# EAGLE design Spectrometer_v1.0 (EAGLE 9.3.0)
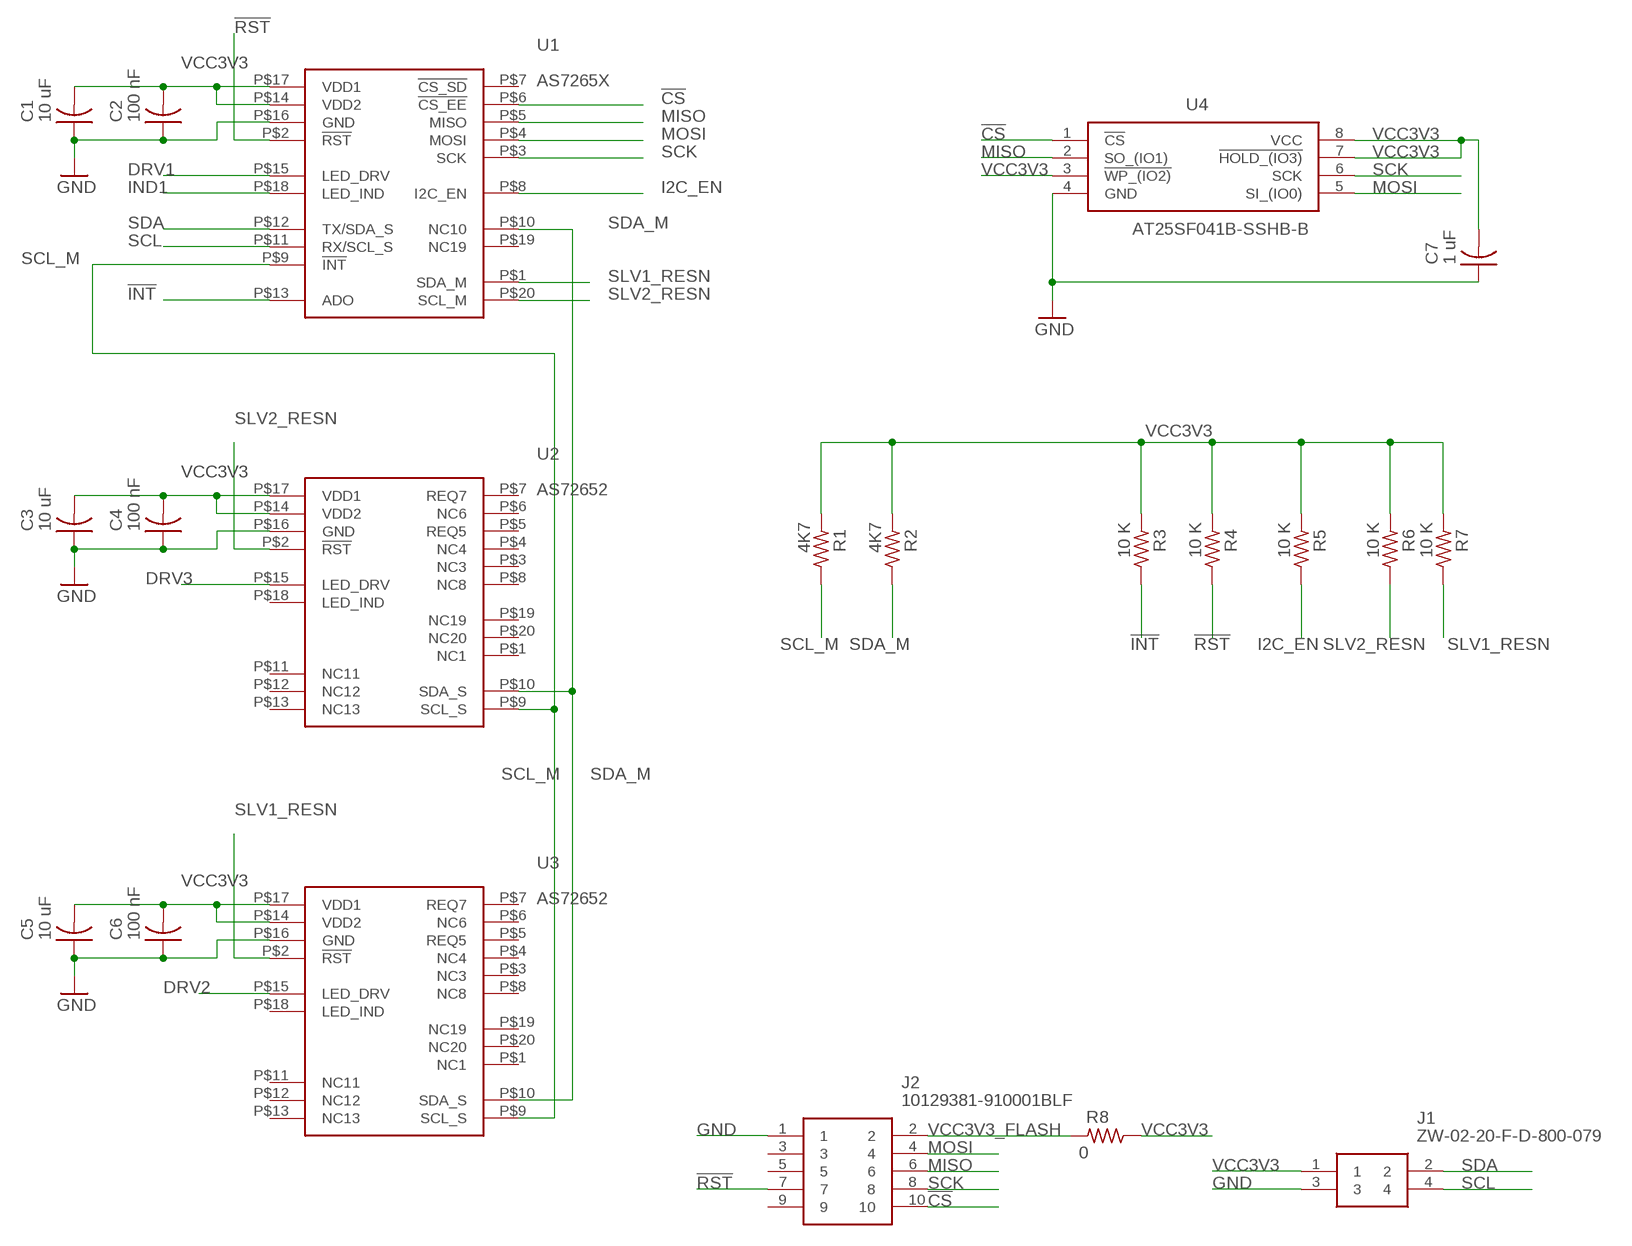
[diagram p0: schematic, sheet 1]

## Parts
C1  10 uF  CAPACITOR-SMD-0805  [SMD-0805]
C2  100 nF  CAPACITOR-SMD-0805  [SMD-0805]
C3  10 uF  CAPACITOR-SMD-0805  [SMD-0805]
C4  100 nF  CAPACITOR-SMD-0805  [SMD-0805]
C5  10 uF  CAPACITOR-SMD-0805  [SMD-0805]
C6  100 nF  CAPACITOR-SMD-0805  [SMD-0805]
C7  1 uF  CAPACITOR-SMD-0805  [SMD-0805]
J1  ZW-02-20-F-D-800-079  [HDRV4W64P254_2X2_508X508X2669P]
J2  10129381-910001BLF  [HDRV10W67P254_2X5_1270X483X858]
R1  4K7  RESISTOR-SMD-0805  [SMD-0805]
R2  4K7  RESISTOR-SMD-0805  [SMD-0805]
R3  10 K  RESISTOR-SMD-0805  [SMD-0805]
R4  10 K  RESISTOR-SMD-0805  [SMD-0805]
R5  10 K  RESISTOR-SMD-0805  [SMD-0805]
R6  10 K  RESISTOR-SMD-0805  [SMD-0805]
R7  10 K  RESISTOR-SMD-0805  [SMD-0805]
R8  0  RESISTOR-SMD-0805  [SMD-0805]
U1  AS7265X  [AS7265X]
U2  AS72652  [AS7265X]
U3  AS72652  [AS7265X]
U4  AT25SF041B-SSHB-B  [SOIC127P600X175-8N]

## Nets
!CS: J2.10 U1.P$6(!CS_EE) U4.1(!CS)
!INT: R3.1 U1.P$13(ADO)
!RST: J2.7 R4.1 U1.P$2(!RST)
DRV1: U1.P$15(LED_DRV)
DRV2: U3.P$15(LED_DRV)
DRV3: U2.P$15(LED_DRV)
GND: C1.1 C2.1 C3.1 C4.1 C5.1 C6.1 C7.1 J1.3 J2.1 U1.P$16(GND) U2.P$16(GND) U3.P$16(GND) U4.4(GND)
I2C_EN: R5.1 U1.P$8(I2C_EN)
IND1: U1.P$18(LED_IND)
MISO: J2.6 U1.P$5(MISO) U4.2(SO_(IO1))
MOSI: J2.4 U1.P$4(MOSI) U4.5(SI_(IO0))
SCK: J2.8 U1.P$3(SCK) U4.6(SCK)
SCL: J1.4 U1.P$11(RX/SCL_S)
SCL_M: R1.1 U1.P$9(!INT) U2.P$9(SCL_S) U3.P$9(SCL_S)
SDA: J1.2 U1.P$12(TX/SDA_S)
SDA_M: R2.1 U1.P$10(NC10) U2.P$10(SDA_S) U3.P$10(SDA_S)
SLV1_RESN: R7.1 U1.P$1(SDA_M) U3.P$2(!RST)
SLV2_RESN: R6.1 U1.P$20(SCL_M) U2.P$2(!RST)
VCC3V3: C1.2 C2.2 C3.2 C4.2 C5.2 C6.2 C7.2 J1.1 R1.2 R2.2 R3.2 R4.2 R5.2 R6.2 R7.2 R8.1 U1.P$14(VDD2) U1.P$17(VDD1) U2.P$14(VDD2) U2.P$17(VDD1) U3.P$14(VDD2) U3.P$17(VDD1) U4.3(!WP_(IO2)) U4.7(!HOLD_(IO3)) U4.8(VCC)
VCC3V3_FLASH: J2.2 R8.2
Unconnected: J2.3 J2.5 J2.9 U1.P$7(!CS_SD) U1.P$19(NC19) U2.P$1(NC1) U2.P$3(NC3) U2.P$4(NC4) U2.P$5(REQ5) U2.P$6(NC6) U2.P$7(REQ7) U2.P$8(NC8) U2.P$11(NC11) U2.P$12(NC12) U2.P$13(NC13) U2.P$18(LED_IND) U2.P$19(NC19) U2.P$20(NC20) U3.P$1(NC1) U3.P$3(NC3) U3.P$4(NC4) U3.P$5(REQ5) U3.P$6(NC6) U3.P$7(REQ7) U3.P$8(NC8) U3.P$11(NC11) U3.P$12(NC12) U3.P$13(NC13) U3.P$18(LED_IND) U3.P$19(NC19) U3.P$20(NC20)

## Library data of the parts
C1-C7 = Fuzzy:CAPACITOR-SMD-0805
J1 = SamacSys_Parts:ZW-02-20-F-D-800-079: .100" Flex Stack, Flexible Board Stacker, Custom Tail, positions, row Source: Datasheet <https://componentsearchengine.com/Datasheets/1/ZW-02-20-F-D-800-079.pdf>; DESCRIPTION: .100" Flex Stack, Flexible Board Stacker, Custom Tail, positions, row; HEIGHT: 26.693mm; MANUFACTURER_NAME: SAMTEC; MANUFACTURER_PART_NUMBER: ZW-02-20-F-D-800-079; MOUSER_PART_NUMBER: 200-ZW0220FD800079; MOUSER_PRICE-STOCK: https://www.mouser.com/Search/Refine.aspx?Keyword=200-ZW0220FD800079
J2 = SamacSys_Parts:10129381-910001BLF: EconoStik , Board to Board connector, Unshrouded Vertical Header, Through Hole, Double Row, 10 Positions, 2.54 mm (0.100in) Pitch Source: Datasheet <https://cdn.amphenol-icc.com/media/wysiwyg/files/drawing/10129381.pdf>; DESCRIPTION: EconoStik , Board to Board connector, Unshrouded Vertical Header, Through Hole, Double Row, 10 Positions, 2.54 mm (0.100in) Pitch; HEIGHT: 8.58mm; MANUFACTURER_NAME: Amphenol; MANUFACTURER_PART_NUMBER: 10129381-910001BLF; MOUSER_PART_NUMBER: 649-1012938191001BLF; MOUSER_PRICE-STOCK: https://www.mouser.co.uk/ProductDetail/Amphenol-FCI/10129381-910001BLF/?qs=0lQeLiL1qyYhmE%2FYsfo%2FnQ%3D%3D
R1-R8 = Fuzzy:RESISTOR-SMD-0805
U1 = kris:AS7265X: AS7265X AMG Smart Spectral Sensor http://ams.com/eng/Products/Spectral-Sensing/Multi-spectral-Sensing/AS7265x
U2 U3 = kris:AS72652: AS72652/3
U4 = SamacSys_Parts:AT25SF041B-SSHB-B: NOR Flash 4 Mbit, 3.0V (2.7V to 3.6V), -40C to 85C, SOIC-N 150mil (Tube), Single, Dual, Quad SPI NOR flash Source: Datasheet <https://www.arrow.com/en/products/at25sf041b-sshb-b/adesto-technologies-corporation-inc>; DESCRIPTION: NOR Flash 4 Mbit, 3.0V (2.7V to 3.6V), -40C to 85C, SOIC-N 150mil (Tube), Single, Dual, Quad SPI NOR flash; HEIGHT: 1.75mm; MANUFACTURER_NAME: Adesto Technologies; MANUFACTURER_PART_NUMBER: AT25SF041B-SSHB-B; MOUSER_PART_NUMBER: 988-AT25SF041-SSH-B; MOUSER_PRICE-STOCK: https://www.mouser.co.uk/ProductDetail/Adesto-Technologies/AT25SF041B-SSHB-B/?qs=wnTfsH77Xs73Fk2dGMWFUw%3D%3D

## Net classes
0 default: width 0.254 mm, drill 0.508 mm, clearance 0.203 mm
1 Power: width 0.305 mm

## Board
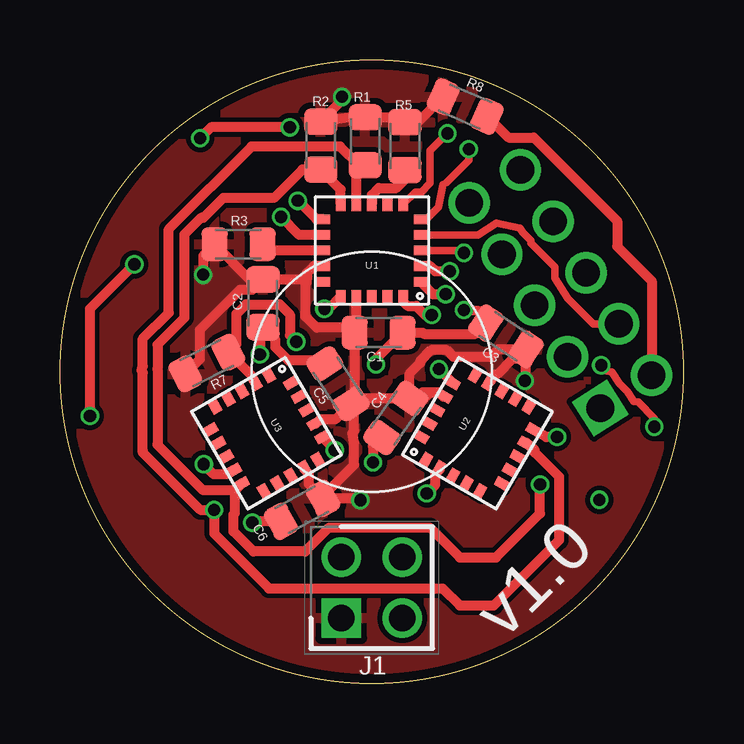
[diagram p1: board, top side]
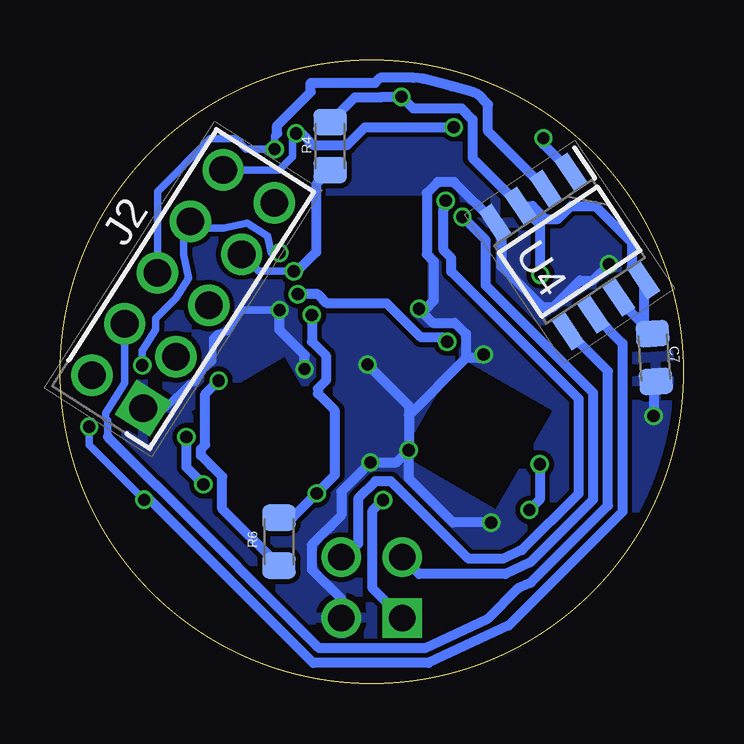
[diagram p2: board, bottom side, seen from below]

Size 26 x 26 mm. Coordinates in mm from the lower left corner, seen from the top.
Outline: circle at 13,13 radius 13
Copper layers (1*16): Top 0.035559375mm / dielectric 0.17018125mm / Bottom 0.035559375mm
Design rules "oshpark-4layer *": minimum track width 5mil, minimum drill 10mil, track to track 5mil, track to pad 5mil, pad to pad 5mil, via to via 5mil, smd to smd 5mil, copper to edge 15mil, drill to drill 6mil, minimum pad ring 4mil, minimum via ring 4mil, stop-mask expansion 2.5mil, vias tented up to drill 20mil, thermal gap 10mil

### Footprints (pad centres in the part's own frame; a part is rotated, then mirrored left to right if it is on the bottom)
SMD-0805 = smd 1.1 x 1.4: 1 -1,0; 2 1,0
HDRV4W64P254_2X2_508X508X2669P = drill 1.1 pad 1.65 square: 1 -1.27,-1.27 | drill 1.1 pad 1.65: 2 -1.27,1.27; 3 1.27,-1.27; 4 1.27,1.27
HDRV10W67P254_2X5_1270X483X858 = drill 1.15 pad 1.725 square: 1 0,0 | drill 1.15 pad 1.725: 2 0,2.54; 3 2.54,0; 4 2.54,2.54; 5 5.08,0; 6 5.08,2.54; 7 7.62,0; 8 7.62,2.54; 9 10.16,0; 10 10.16,2.54
AS7265X = smd 0.55 x 0.4: P$1 -2.025,1.3; P$2 -2.025,0.65; P$3 -2.025,0; P$4 -2.025,-0.65; P$5 -2.025,-1.3; P$11 2.025,-1.3; P$12 2.025,-0.65; P$13 2.025,0; P$14 2.025,0.65; P$15 2.025,1.3 | smd 0.4 x 0.55: P$6 -1.3,-1.925; P$7 -0.65,-1.925; P$8 0,-1.925; P$9 0.65,-1.925; P$10 1.3,-1.925; P$16 1.3,1.925; P$17 0.65,1.925; P$18 0,1.925; P$19 -0.65,1.925; P$20 -1.3,1.925
SOIC127P600X175-8N = smd 1.525 x 0.65: 1 -2.712,1.905; 2 -2.712,0.635; 3 -2.712,-0.635; 4 -2.712,-1.905; 5 2.712,-1.905; 6 2.712,-0.635; 7 2.712,0.635; 8 2.712,1.905

### Placement (x,y rotation side)
C1  13.29,14.63 180 top
C2  8.46,15.85 90 top
C3  18.6,14.48 326.8 top
C4  14,11.08 54.8 top
C5  11.59,12.5 303.1 top
C6  10.09,7.24 28.5 top
C7  1.22,13.59 94.1 bottom
J1  13,4 0 top
J2  22.53,11.48 57.4 bottom
R1  12.73,22.61 90 top
R2  10.87,22.43 90 top
R3  7.45,18.32 180 top
R4  14.73,22.41 90 bottom
R5  14.38,22.41 90 top
R6  16.87,5.92 270 bottom
R7  6.12,13.36 206.9 top
R8  16.89,24.06 336.2 top
U1  13.01,18.05 180 top
U2  17.41,10.43 60 top
U3  8.61,10.43 300 top
U4  4.75,18.01 303.9 bottom

### Tracks (layer width: path | path; a pad name or v marks a point on that pad's centre or on a via)
!CS  (via drill 0.51)
  Top 0.305: U1.P$6 14.83,20.5 15.06,20.5 15.44,20.87 15.44,22.22 v16.16,22.94
  Top 0.406: v9.58,23.19 6.3,23.19 v5.85,22.74
  Bottom 0.305: v16.16,22.94 16.31,22.79 16.31,21.97 16.87,21.41 J2.10
  Bottom 0.406: U4.1 5.85,22.49 v5.85,22.74 | v16.16,22.94 15.93,22.94 15.44,22.45 14.03,22.45 13.29,23.19 v9.58,23.19
!INT
  Top 0.406: U1.P$13 8.71,18.05 R3.1
!RST  (via drill 0.51)
  Top 0.406: v16.25,17.19 15.65,17.19 15.42,17.41 15.04,17.41 U1.P$2
  Bottom 0.305: v16.25,17.19 17.71,17.19 J2.7
  Bottom 0.406: R4.1 15.32,20.82 15.32,17.99 16.11,17.19 v16.25,17.19
GND  (via drill 0.51)
  Top 0.406: v16.85,15.57 17.76,15.51 C3.1 17.31,14.58 15.17,14.58 15.12,14.63 C1.1 13.18,13.52 v13.18,13.3 | U3.P$16 v11.46,9.74 v11.46,9.73 | 10.72,13.45 10.72,13.34 C5.1 10.91,13.46 9.53,13.46 8.98,14.01 8.98,14.33 C2.1 8.34,14.73 v8.34,13.72 | U1.P$16 11.2,15.62 v11.03,15.62 | C6.1 8.08,6.77 v8.02,6.71 | U2.P$16 v15.8,13.11 | C4.1 13.05,9.89 v13.05,9.22 | v3.1,17.48 1.25,15.62 v1.25,11.15
  Bottom 0.305: v16.85,15.57 18.44,15.57 18.52,15.49 19.04,14.68 19.42,14.6 19.64,14.38 19.64,13.44 19.71,13.36 19.74,13.36 20.14,12.96 20.41,12.54 20.6,12.5 21.62,11.48 J2.1
  Bottom 0.406: 9.07,13.57 9.07,14.58 9.53,15.04 10.44,15.04 v11.03,15.62 10.75,15.62 10.42,15.95 10.42,17.61 10.71,17.9 10.71,20.45 10.24,20.92 9.57,20.92 U4.4 7.6,18.95 7.6,17.4 5.9,15.7 5.43,15.7 4.32,16.81 3.77,16.81 3.76,16.82 v3.1,17.48 | 11.46,11.18 v11.46,9.73 | 9.07,13.57 11.46,11.18 | v8.34,13.72 8.49,13.57 9.07,13.57 | v8.02,6.71 9.61,6.71 11.46,8.56 v11.46,9.73 | v15.8,13.11 15.8,13.7 16.85,14.74 v16.85,15.57 | v13.18,13.3 11.46,11.58 11.46,11.18 | v11.46,9.73 11.97,9.22 v13.05,9.22 14.27,8 14.27,7.01 15.5,5.78 15.5,4.76 14.27,3.53 J1.3 | C7.1 1.25,12.5 v1.25,11.15
  pour Bottom: 1.83,26.29 26.14,26.29 26.55,25.89 26.55,0.21 -1.32,0.21 -1.37,0.16 -1.37,24.72 -0.2,25.89
I2C_EN
  Top 0.406: U1.P$8 13,20.37 13.29,20.66 14.02,20.66 14.38,21.02 R5.1
MISO  (via drill 0.51)
  Top 0.305: U1.P$5 15.26,19.35 15.77,19.86 15.98,20.8 16.11,20.88 17.05,21.82 v17.05,22.28
  Bottom 0.305: 16.95,22.94 17.05,22.84 v17.05,22.28 18.23,22.28 18.66,22.71 19.74,22.71 21.93,20.51 J2.6
  Bottom 0.406: U4.2 8.15,23.03 8.15,24.14 8.58,24.57 8.76,24.66 9.67,24.9 10.85,25.21 11.26,25.25 12.65,25.25 12.86,25.05 15.54,25.05 15.54,24.67 16.95,23.27 16.95,22.94
MOSI
  Top 0.305: U1.P$4 17.42,18.7 18.2,19.2 19.18,18.98 19.29,18.81 19.63,18.47 19.63,18.37 20.64,17.37 20.64,16.9 21.18,16.05 22.24,14.99 J2.4
  Bottom 0.305: J2.4 23.3,12.54 24.1,11.29 24.1,11.06 24,10.96 24,10.28
  Bottom 0.406: U4.5 3.15,13.03 3.15,7.42 6.36,4.21 6.42,4.18 6.9,3.96 8.18,2.68 10.77,1.47 15.19,1.47 21.95,8.23 22.01,8.29 24,10.28
NONE
  cutout Bottom: 10.7,20.3 15.4,20.3 15.4,15.88 15.5,15.78 10.72,15.78 10.67,15.83 10.67,20.27
  cutout Top: 10.67,20.35 15.37,20.35 15.4,20.32 15.4,15.85 15.29,15.75 10.65,15.75 10.65,20.32 10.64,20.33
  cutout Top: 5.49,11.43 9.32,13.57 11.71,9.58 7.83,7.27 5.49,11.36
  cutout Top: 14.28,9.5 16.64,13.59 20.53,11.33 18.21,7.29 14.33,9.5
  cutout Bottom: 16.64,13.59 20.5,11.33 18.21,7.29 14.3,9.53 16.61,13.57
  cutout Bottom: 5.49,11.36 9.38,13.59 11.71,9.55 7.85,7.29
SCK  (via drill 0.51)
  Top 0.305: U1.P$3 16.75,18.05 v16.84,17.96 | v24.79,10.71 24.79,11.05 24.11,11.73 23.92,11.77 23.66,12.18 23.32,12.52 23.02,12.99 22.8,13.04 v22.57,13.27
  Bottom 0.305: v16.84,17.96 17.19,17.96 17.35,18.66 18.2,19.2 19.18,18.98 20.28,18.98 J2.8 20.85,18.98 20.85,17.89 20.64,16.9 21.18,16.05 22.01,15.23 22.01,14.76 22.55,13.91 22.57,13.89 v22.57,13.27 | v22.49,7.66 24.79,9.95 v24.79,10.71
  Bottom 0.406: U4.6 2.54,14.18 2.54,7.17 7.28,2.43 10.63,0.86 15.44,0.86 22.15,7.57 22.24,7.66 v22.49,7.66
SCL  (via drill 0.51)
  Top 0.406: U1.P$11 10.69,19.36 v9.92,20.13
  Bottom 0.406: v9.92,20.13 9.92,19.88 10.01,19.79 10.01,18.06 9.68,17.73 9.68,17.17 4.37,11.87 4.37,7.92 6.73,5.56 7.51,5.2 8.96,5.2 12.2,8.44 12.85,8.44 13.57,7.72 13.57,5.83 14.2,5.2 J1.4
SCL_M  (via drill 0.51)
  Top 0.406: U1.P$9 12.36,21.24 R1.1 12.46,21.61 11.68,22.39 7.99,22.39 4.54,18.94 4.54,15.46 3.46,14.38 3.46,13.23 3.4,13.06 3.45,12.96 3.45,9.71 3.46,9.71 3.46,9.63 5.85,7.24 v6.43,7.24 6.43,6.25 8.72,3.96 15.96,3.96 16.67,3.25 18.08,3.25 20.8,5.97 20.8,8.63 19.8,9.63 19.76,9.78 19.64,9.85 19.45,10.04 U2.P$9 | v6,9.14 6.42,8.72 6.95,8.72 U3.P$9
  Bottom 0.406: v6,9.14 6,7.68 v6.43,7.24
SDA  (via drill 0.51)
  Top 0.406: U1.P$12 9.98,18.7 v9.22,19.46
  Bottom 0.406: v9.22,19.46 8.24,18.48 8.24,16.6 3.76,12.12 3.76,7.67 6.38,5.06 7.42,4.57 11.03,4.57 J1.2
SDA_M  (via drill 0.51)
  Top 0.406: U1.P$10 11.71,20.6 R2.1 10.11,21.43 8.92,20.25 6.81,20.25 5.99,19.42 5.89,19.42 5.18,18.72 5.18,15.24 4.07,14.12 4.07,13.13 4.06,13.11 4.07,13.09 4.07,9.97 4.06,9.97 5.97,8.05 7.3,8.05 | v20.02,8.3 20.02,7.09 18.18,5.25 16.67,5.25 15.42,6.5 11.22,6.5 10.22,5.5 8.07,5.5 7.24,6.33 7.24,7.04 7.3,7.1 7.3,8.05 | v20.73,10.28 20.28,10.28 U2.P$10 | U3.P$10 7.3,8.05
  Bottom 0.406: v20.02,8.3 20.73,9.01 v20.73,10.28
SLV1_RESN  (via drill 0.51)
  Top 0.406: U3.P$2 7.94,12.89 R7.1 7.36,14.15 7.36,15.41 7.75,15.81 9.17,15.81 9.59,15.38 9.59,14.52 v9.86,14.25 | U1.P$1 15.55,16.23 v16.08,16.23
  Bottom 0.406: v9.86,14.25 10.04,14.43 10.95,14.43 12.37,15.85 14.86,15.85 15.24,16.23 v16.08,16.23
SLV2_RESN  (via drill 0.51)
  Top 0.406: U1.P$20 14.31,15.93 14.49,15.74 14.84,15.74 15.21,15.37 v15.5,15.37 | U2.P$2 15.83,8.92 15.65,8.73 15.65,8.28 v15.29,7.93
  Bottom 0.406: v15.5,15.37 15.5,14.26 14.91,13.67 14.91,12.63 15.24,12.3 15.24,12.09 14.53,11.38 14.53,8.69 v15.29,7.93 16.3,6.92 R6.1
VCC3V3  (via drill 0.51)
  Top 0.406: 19.3,13.93 C3.2 | C1.2 12.36,14.7 U1.P$17 | U3.P$14 10.18,8.94 10.37,8.76 10.37,8.32 C6.2 | U3.P$17 10.66,10.83 10.85,11.02 11.49,11.02 C5.2 | C4.2 12.36,11.89 12.29,11.82 | C2.2 7.91,16.85 R3.2 5.97,17.84 v5.97,17.05 | U1.P$14 10.97,17.41 10.59,17.41 10.3,17.12 10.3,16.85 C2.2 | C1.2 12.29,11.82 | 12.29,11.82 C5.2 | v12.53,7.65 12.45,7.73 C6.2 | C6.2 10.87,7.73 12.26,9.12 12.26,10.05 12.2,10.44 12.26,10.54 12.26,11.53 C5.2 | C4.2 14.87,11.89 15.12,12.14 15.42,12.14 | C1.2 12.08,14.84 10.7,14.84 10.24,15.3 10.24,16.66 10.3,16.72 | C4.2 14.57,12.07 | 14.57,12.07 14.57,12.92 15.01,13.36 15.01,13.44 15.47,13.9 16.13,13.9 16.41,13.62 17.95,13.62 18.27,13.93 C3.2 | C3.2 19.04,13.54 18.88,13.54 18.26,12.91 18.12,12.88 17.98,12.63 U2.P$14 | R7.2 5.84,13.52 5.84,14.76 7.5,16.42 8.03,16.42 C2.2 | v11.76,24.46 11.76,24.32 R2.2 12.17,23.61 R1.2 12.74,23.6 14.19,23.6 R5.2 14.92,23.41 R8.1 | v19.38,12.63 19.43,12.72 C3.2 | 14.57,12.07 14.68,11.96 15.24,11.96 15.42,12.14 | U2.P$17 15.98,11.96 15.79,12.14 15.42,12.14
  Bottom 0.406: U4.7 2.71,16.01 C7.2 1.66,14.96 U4.8 2.16,17.33 2.16,18.39 3.68,19.91 4.7,19.91 5.23,19.37 5.76,19.37 6.3,19.91 6.76,19.91 | J1.1 12.96,3.96 12.96,7.21 v12.53,7.65 | 6.76,19.91 U4.3 8.79,21.91 8.79,23.52 9.25,23.98 11.28,23.98 v11.76,24.46 12.58,24.46 12.6,24.44 13.7,24.44 R4.2 | v5.97,17.05 5.97,19.12 6.76,19.91 | R6.2 19.23,7.28 19.23,8.63 19.69,9.09 19.71,9.09 20.12,9.5 20.12,9.78 19.94,9.95 19.94,12.07 v19.38,12.63
  pour Top: -0.02,26.34 27.46,26.34 27.99,25.81 27.99,0.36 28.07,0.28 -1.11,0.28 -1.11,25.25
VCC3V3_FLASH
  Top 0.406: J2.2 24.67,16.79 23.23,18.23 23.23,19.29 19.76,22.76 18.7,22.76 R8.2

### Text on the board
tPlace: v1.0